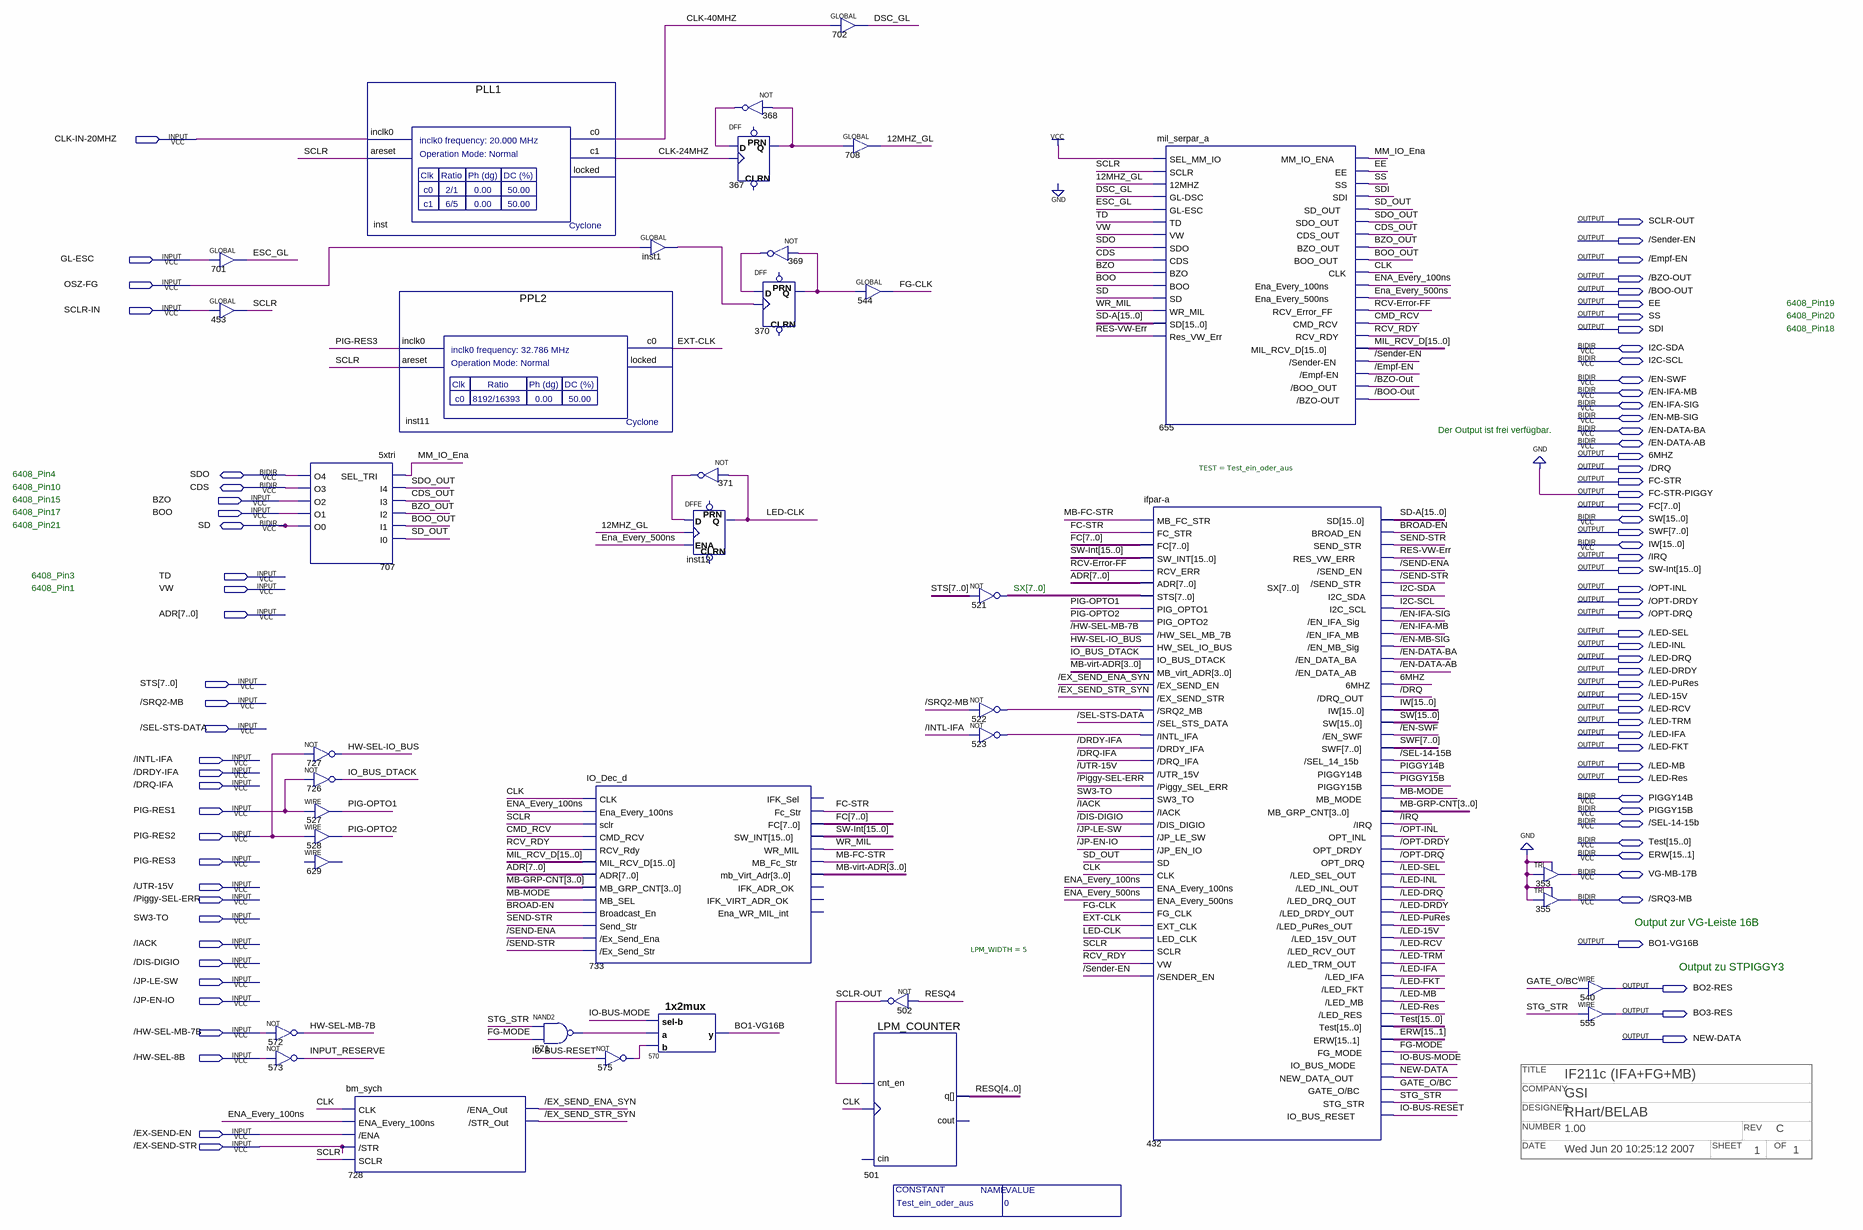
[diagram p0: schematic sheet]
// Quartus schematic if211c.bdf as structural Verilog: 38 symbols, 84 pins
// Title block: TITLE: IF211c (IFA+FG+MB); COMPANY: GSI; DESIGNER: RHart/BELAB; NUMBER: 1.00; REV: C; DATE: Wed Jun 20 10:25:12 2007; SHEET: 1; OF: 1
module if211c #(parameter Test_ein_oder_aus = 0) (
  input  \CLK-IN-20MHZ ,
  input  \GL-ESC ,
  input  \OSZ-FG ,
  input  \SCLR-IN ,
  input  BZO,
  input  BOO,
  input  TD,
  input  VW,
  input  [7:0] ADR,
  input  [7:0] STS,
  input  \/SRQ2-MB ,
  input  \/SEL-STS-DATA ,
  input  \/INTL-IFA ,
  input  \/DRDY-IFA ,
  input  \/DRQ-IFA ,
  input  \PIG-RES1 ,
  input  \PIG-RES2 ,
  input  \PIG-RES3 ,
  input  \/UTR-15V ,
  input  \/Piggy-SEL-ERR ,
  input  \SW3-TO ,
  input  \/IACK ,
  input  \/DIS-DIGIO ,
  input  \/JP-LE-SW ,
  input  \/JP-EN-IO ,
  input  \/HW-SEL-MB-7B ,
  input  \/HW-SEL-8B ,
  input  \/EX-SEND-EN ,
  input  \/EX-SEND-STR ,
  inout  \I2C-SDA ,
  inout  \I2C-SCL ,
  inout  \/EN-SWF ,
  inout  \/EN-IFA-MB ,
  inout  \/EN-IFA-SIG ,
  inout  \/EN-MB-SIG ,
  inout  \/EN-DATA-BA ,
  inout  \/EN-DATA-AB ,
  inout  SDO,
  inout  CDS,
  inout  [15:0] SW,
  inout  SD,
  inout  [15:0] IW,
  inout  PIGGY14B,
  inout  PIGGY15B,
  inout  \/SEL-14-15b ,
  inout  [15:0] Test,
  inout  [15:1] ERW,
  inout  \VG-MB-17B ,
  inout  \/SRQ3-MB ,
  output \SCLR-OUT ,
  output \/Sender-EN ,
  output \/Empf-EN ,
  output \/BZO-OUT ,
  output \/BOO-OUT ,
  output EE,
  output SS,
  output SDI,
  output \6MHZ ,
  output \/DRQ ,
  output \FC-STR ,
  output \FC-STR-PIGGY ,
  output [7:0] FC,
  output [7:0] SWF,
  output \/IRQ ,
  output [15:0] \SW-Int ,
  output \/OPT-INL ,
  output \/OPT-DRDY ,
  output \/OPT-DRQ ,
  output \/LED-SEL ,
  output \/LED-INL ,
  output \/LED-DRQ ,
  output \/LED-DRDY ,
  output \/LED-PuRes ,
  output \/LED-15V ,
  output \/LED-RCV ,
  output \/LED-TRM ,
  output \/LED-IFA ,
  output \/LED-FKT ,
  output \/LED-MB ,
  output \/LED-Res ,
  output \BO1-VG16B ,
  output \BO2-RES ,
  output \BO3-RES ,
  output \NEW-DATA 
);

  wire \12MHZ_GL , \/EX_SEND_ENA_SYN , \/EX_SEND_STR_SYN , \/SEND-ENA , \/SEND-STR , BOO_OUT, \BROAD-EN ,
       BZO_OUT, CDS_OUT, CLK, \CLK-24MHZ , \CLK-40MHZ , CMD_RCV, DSC_GL, ENA_Every_100ns, ENA_Every_500ns,
       ESC_GL, \EXT-CLK , \FG-CLK , \FG-MODE , \GATE_O/BC , \HW-SEL-IO_BUS , \HW-SEL-MB-7B , INPUT_RESERVE,
       \IO-BUS-MODE , \IO-BUS-RESET , IO_BUS_DTACK, \LED-CLK , \MB-FC-STR , \MB-MODE , MM_IO_Ena, n367_q,
       n368_out, n369_out, n370_q, n371_out, n522_out, n523_out, n571_out, n575_out, \PIG-OPTO1 ,
       \PIG-OPTO2 , \RCV-Error-FF , RCV_RDY, \RES-VW-Err , SCLR, SD_OUT, SDO_OUT, \SEND-STR , STG_STR, WR_MIL;
  wire [3:0] \MB-GRP-CNT , \MB-virt-ADR ;
  wire [4:0] RESQ;
  wire [7:0] SX;
  wire [15:0] MIL_RCV_D, \SD-A ;

  GLOBAL u_701 (.IN(\GL-ESC ), .OUT(ESC_GL));
  GLOBAL u_453 (.IN(\SCLR-IN ), .OUT(SCLR));
  \5xtri  u_707 (
    .SEL_TRI(MM_IO_Ena), .I4(SDO_OUT), .I3(CDS_OUT), .I2(BZO_OUT), .I1(BOO_OUT), .I0(SD_OUT), .O4(SDO),
    .O3(CDS), .O2(BZO), .O1(BOO), .O0(SD));
  not u_727 (\HW-SEL-IO_BUS , \PIG-RES2 );
  not u_726 (IO_BUS_DTACK, \PIG-RES1 );
  assign \PIG-OPTO1  = \PIG-RES1 ;  // WIRE 527
  assign \PIG-OPTO2  = \PIG-RES2 ;  // WIRE 528
  // WIRE 629 has open pins
  not u_572 (\HW-SEL-MB-7B , \/HW-SEL-MB-7B );
  not u_573 (INPUT_RESERVE, \/HW-SEL-8B );
  bm_sych u_728 (
    .CLK(CLK), .ENA_Every_100ns(ENA_Every_100ns), .\/ENA (\/EX-SEND-EN ), .\/STR (\/EX-SEND-STR ),
    .SCLR(SCLR), .\/ENA_Out (\/EX_SEND_ENA_SYN ), .\/STR_Out (\/EX_SEND_STR_SYN ));
  PLL1 inst (.inclk0(\CLK-IN-20MHZ ), .areset(SCLR), .c0(\CLK-40MHZ ), .c1(\CLK-24MHZ ));  // open: locked
  PPL2 inst11 (.inclk0(\PIG-RES3 ), .areset(SCLR), .c0(\EXT-CLK ));  // open: locked
  nand u_571 (n571_out, STG_STR, \FG-MODE );
  IO_Dec_d u_733 (
    .CLK(CLK), .Ena_Every_100ns(ENA_Every_100ns), .sclr(SCLR), .CMD_RCV(CMD_RCV), .RCV_Rdy(RCV_RDY),
    .MIL_RCV_D(MIL_RCV_D), .ADR(ADR), .MB_GRP_CNT(\MB-GRP-CNT ), .MB_SEL(\MB-MODE ),
    .Broadcast_En(\BROAD-EN ), .Send_Str(\SEND-STR ), .\/Ex_Send_Ena (\/SEND-ENA ),
    .\/Ex_Send_Str (\/SEND-STR ), .Fc_Str(\FC-STR ), .FC(FC), .SW_INT(\SW-Int ), .WR_MIL(WR_MIL),
    .MB_Fc_Str(\MB-FC-STR ), .mb_Virt_Adr(\MB-virt-ADR ));  // open: IFK_Sel, IFK_ADR_OK, IFK_VIRT_ADR_OK, Ena_WR_MIL_int
  not u_575 (n575_out, \IO-BUS-RESET );
  GLOBAL inst1 (.IN(\OSZ-FG ), .OUT(\OSZ-FG ));
  \1x2mux  u_570 (.\sel-b (\IO-BUS-MODE ), .a(n571_out), .b(n575_out), .y(\BO1-VG16B ));
  not u_371 (n371_out, \LED-CLK );
  DFFE inst12 (.D(n371_out), .CLK(\12MHZ_GL ), .ENA(ENA_Every_500ns), .Q(\LED-CLK ));  // open: PRN, CLRN
  not u_368 (n368_out, n367_q);
  DFF u_367 (.CLK(\CLK-24MHZ ), .D(n368_out), .Q(n367_q));  // open: CLRN, PRN
  not u_369 (n369_out, n370_q);
  DFF u_370 (.CLK(\OSZ-FG ), .D(n369_out), .Q(n370_q));  // open: CLRN, PRN
  GLOBAL u_702 (.IN(\CLK-40MHZ ), .OUT(DSC_GL));
  GLOBAL u_708 (.IN(n367_q), .OUT(\12MHZ_GL ));
  GLOBAL u_544 (.IN(n370_q), .OUT(\FG-CLK ));
  LPM_COUNTER #(.LPM_WIDTH(5)) u_501 (.cnt_en(\SCLR-OUT ), .clock(CLK), .q(RESQ));  // open: cin, cout
  not u_502 (\SCLR-OUT , RESQ[4]);
  assign SX = ~STS;  // NOT 521, 8 bits wide
  not u_522 (n522_out, \/SRQ2-MB );
  not u_523 (n523_out, \/INTL-IFA );
  mil_serpar_a u_655 (
    .SEL_MM_IO(1'b1), .SCLR(SCLR), .\12MHZ (\12MHZ_GL ), .\GL-DSC (DSC_GL), .\GL-ESC (ESC_GL), .TD(TD),
    .VW(VW), .SDO(SDO), .CDS(CDS), .BZO(BZO), .BOO(BOO), .SD({\SD-A [15:1], SD, \SD-A [0]}), .WR_MIL(WR_MIL),
    .Res_VW_Err(\RES-VW-Err ), .MM_IO_ENA(MM_IO_Ena), .EE(EE), .SS(SS), .SDI(SDI), .SD_OUT(SD_OUT),
    .SDO_OUT(SDO_OUT), .CDS_OUT(CDS_OUT), .BZO_OUT(BZO_OUT), .BOO_OUT(BOO_OUT), .CLK(CLK),
    .Ena_Every_100ns(ENA_Every_100ns), .Ena_Every_500ns(ENA_Every_500ns), .RCV_Error_FF(\RCV-Error-FF ),
    .CMD_RCV(CMD_RCV), .RCV_RDY(RCV_RDY), .MIL_RCV_D(MIL_RCV_D), .\/Sender-EN (\/Sender-EN ),
    .\/Empf-EN (\/Empf-EN ), .\/BOO_OUT (\/BZO-OUT ), .\/BZO-OUT (\/BOO-OUT ));
  \ifpar-a  #(.TEST(Test_ein_oder_aus)) u_432 (
    .MB_FC_STR(\MB-FC-STR ), .FC_STR(\FC-STR ), .FC(FC), .SW_INT(\SW-Int ), .RCV_ERR(\RCV-Error-FF ),
    .ADR(ADR), .STS(SX), .PIG_OPTO1(\PIG-OPTO1 ), .PIG_OPTO2(\PIG-OPTO2 ), .\/HW_SEL_MB_7B (\/HW-SEL-MB-7B ),
    .HW_SEL_IO_BUS(\HW-SEL-IO_BUS ), .IO_BUS_DTACK(IO_BUS_DTACK), .MB_virt_ADR(\MB-virt-ADR ),
    .\/EX_SEND_EN (\/EX_SEND_ENA_SYN ), .\/EX_SEND_STR (\/EX_SEND_STR_SYN ), .\/SRQ2_MB (n522_out),
    .\/SEL_STS_DATA (\/SEL-STS-DATA ), .\/INTL_IFA (n523_out), .\/DRDY_IFA (\/DRDY-IFA ),
    .\/DRQ_IFA (\/DRQ-IFA ), .\/UTR_15V (\/UTR-15V ), .\/Piggy_SEL_ERR (\/Piggy-SEL-ERR ), .SW3_TO(\SW3-TO ),
    .\/IACK (\/IACK ), .\/DIS_DIGIO (\/DIS-DIGIO ), .\/JP_LE_SW (\/JP-LE-SW ), .\/JP_EN_IO (\/JP-EN-IO ),
    .SD({\SD-A [15:1], SD_OUT, \SD-A [0]}), .CLK(CLK), .ENA_Every_100ns(ENA_Every_100ns),
    .ENA_Every_500ns(ENA_Every_500ns), .FG_CLK(\FG-CLK ), .EXT_CLK(\EXT-CLK ), .LED_CLK(\LED-CLK ),
    .SCLR(SCLR), .VW(RCV_RDY), .\/SENDER_EN (\/Sender-EN ), .BROAD_EN(\BROAD-EN ), .SEND_STR(\SEND-STR ),
    .RES_VW_ERR(\RES-VW-Err ), .\/SEND_EN (\/SEND-ENA ), .\/SEND_STR (\/SEND-STR ), .\6MHZ (\6MHZ ),
    .\/DRQ_OUT (\/DRQ ), .SWF(SWF), .MB_MODE(\MB-MODE ), .MB_GRP_CNT(\MB-GRP-CNT ), .\/IRQ (\/IRQ ),
    .OPT_INL(\/OPT-INL ), .OPT_DRDY(\/OPT-DRDY ), .OPT_DRQ(\/OPT-DRQ ), .\/LED_SEL_OUT (\/LED-SEL ),
    .\/LED_INL_OUT (\/LED-INL ), .\/LED_DRQ_OUT (\/LED-DRQ ), .\/LED_DRDY_OUT (\/LED-DRDY ),
    .\/LED_PuRes_OUT (\/LED-PuRes ), .\/LED_15V_OUT (\/LED-15V ), .\/LED_RCV_OUT (\/LED-RCV ),
    .\/LED_TRM_OUT (\/LED-TRM ), .\/LED_IFA (\/LED-IFA ), .\/LED_FKT (\/LED-FKT ), .\/LED_MB (\/LED-MB ),
    .\/LED_RES (\/LED-Res ), .FG_MODE(\FG-MODE ), .IO_BUS_MODE(\IO-BUS-MODE ), .NEW_DATA_OUT(\NEW-DATA ),
    .\GATE_O/BC (\GATE_O/BC ), .STG_STR(STG_STR), .IO_BUS_RESET(\IO-BUS-RESET ), .I2C_SDA(\I2C-SDA ),
    .I2C_SCL(\I2C-SCL ), .\/EN_IFA_Sig (\/EN-IFA-SIG ), .\/EN_IFA_MB (\/EN-IFA-MB ),
    .\/EN_MB_Sig (\/EN-MB-SIG ), .\/EN_DATA_BA (\/EN-DATA-BA ), .\/EN_DATA_AB (\/EN-DATA-AB ), .IW(IW),
    .SW(SW), .\/EN_SWF (\/EN-SWF ), .\/SEL_14_15b (\/SEL-14-15b ), .PIGGY14B(PIGGY14B), .PIGGY15B(PIGGY15B),
    .Test(Test), .ERW(ERW));
  TRI u_353 (.IN(1'b0), .OE(1'b0), .OUT(\VG-MB-17B ));
  TRI u_355 (.IN(1'b0), .OE(1'b0), .OUT(\/SRQ3-MB ));
  assign \BO2-RES  = \GATE_O/BC ;  // WIRE 540
  assign \BO3-RES  = STG_STR;  // WIRE 555

  assign \FC-STR-PIGGY  = 1'b0;

  // Notes on the sheet:
  //   6408_Pin19
  //   6408_Pin20
  //   6408_Pin18
  //   Der Output ist frei verfügbar.
  //   6408_Pin4
  //   6408_Pin10
  //   6408_Pin15
  //   6408_Pin17
  //   6408_Pin21
  //   6408_Pin3
  //   6408_Pin1
  //   SX[7..0]
  //   Output zur VG-Leiste 16B
  //   Output zu STPIGGY3
endmodule
